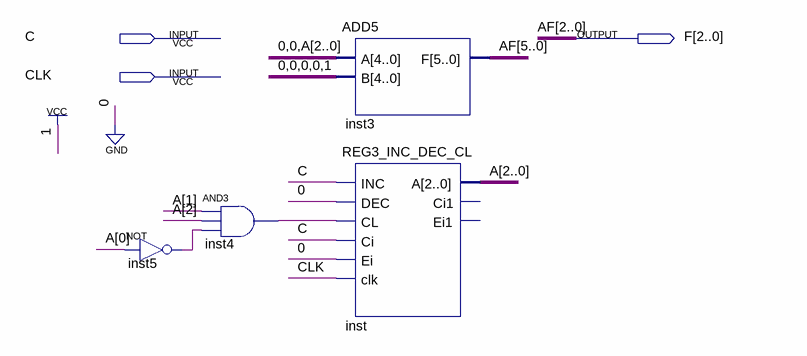
[diagram p0: schematic sheet]
// Quartus schematic main1.bdf as structural Verilog: 4 symbols, 3 pins
module main1 (
  input  C,
  input  CLK,
  output [2:0] F
);

  wire inst4_out, inst5_out;
  wire [2:0] A;
  wire [5:3] AF;

  not inst5 (inst5_out, A[0]);
  and inst4 (inst4_out, A[1], A[2], inst5_out);
  ADD5 inst3 (.A({2'b00, A}), .B(5'b00001), .F({AF, F}));
  REG3_INC_DEC_CL inst (.INC(C), .DEC(1'b0), .CL(inst4_out), .Ci(C), .Ei(1'b0), .clk(CLK), .A(A));  // open: Ci1, Ei1

  // Other names for the same wires on the sheet: AF[2:0] = F
endmodule
